# Altium schematic sheet MotorPower.SchDoc
size A4
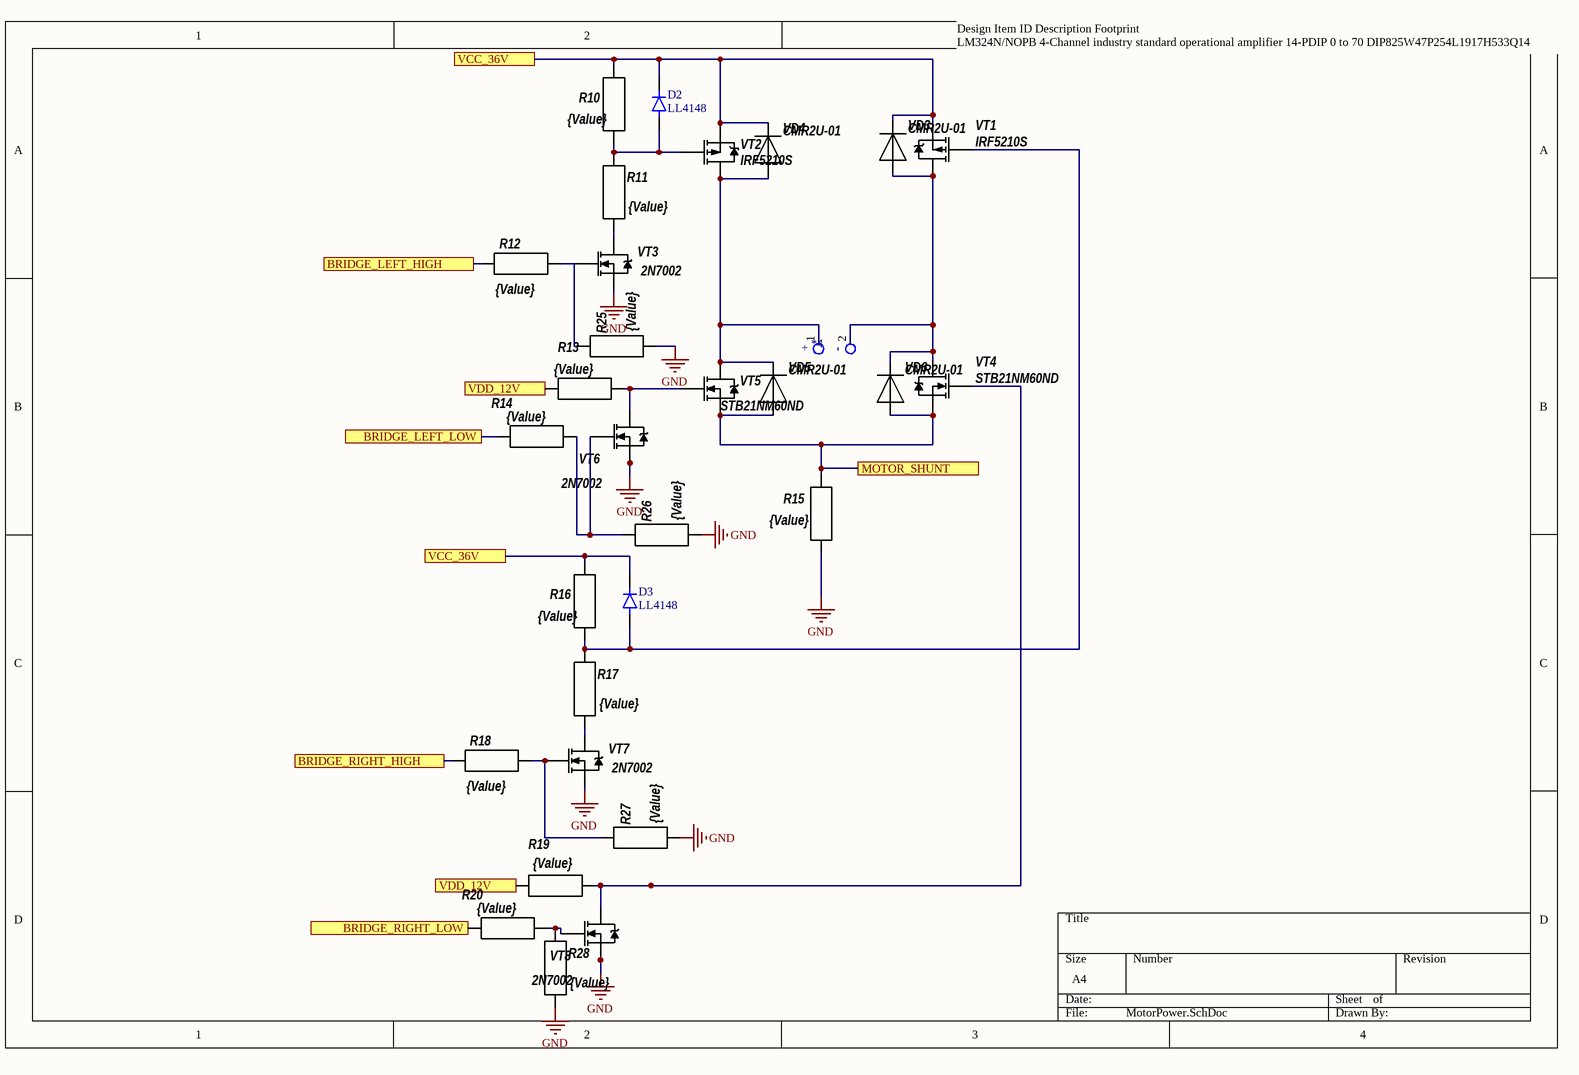
[diagram p0: MotorPower.SchDoc]

## Parts
*4  Power connector 2pin  [Power connector 2 pin]  (value not drawn)
D2  LL4148  [DIO_LL4148]
D3  LL4148  [DIO_LL4148]
R10  value {Value}  [R0805]  (hidden comment: Res 0805)
R11  value {Value}  [R0805]  (hidden comment: Res 0805)
R12  value {Value}  [R0805]  (hidden comment: Res 0805)
R13  value {Value}  [R0805]  (hidden comment: Res 0805)
R14  value {Value}  [R0805]  (hidden comment: Res 0805)
R15  value {Value}  [R2512]  (hidden comment: Res 2512)
R16  value {Value}  [R0805]  (hidden comment: Res 0805)
R17  value {Value}  [R0805]  (hidden comment: Res 0805)
R18  value {Value}  [R0805]  (hidden comment: Res 0805)
R19  value {Value}  [R0805]  (hidden comment: Res 0805)
R20  value {Value}  [R0805]  (hidden comment: Res 0805)
R25  value {Value}  [R0805]  (hidden comment: Res 0805)
R26  value {Value}  [R0805]  (hidden comment: Res 0805)
R27  value {Value}  [R0805]  (hidden comment: Res 0805)
R28  value {Value}  [R0805]  (hidden comment: Res 0805)
VD3  CMR2U-01  [SMB/DO-214AA]
VD4  CMR2U-01  [SMB/DO-214AA]
VD5  CMR2U-01  [SMB/DO-214AA]
VD6  CMR2U-01  [SMB/DO-214AA]
VT1  IRF5210S  [D2Pak]
VT2  IRF5210S  [D2Pak]
VT3  2N7002  [SOT-23]
VT4  STB21NM60ND  [D2Pak]
VT5  STB21NM60ND  [D2Pak]
VT6  2N7002  [SOT-23]
VT7  2N7002  [SOT-23]
VT8  2N7002  [SOT-23]

## Ports
BRIDGE_LEFT_HIGH, BRIDGE_LEFT_LOW, BRIDGE_RIGHT_HIGH, BRIDGE_RIGHT_LOW, MOTOR_SHUNT, VCC_36V, VDD_12V

## Nets
GND: R15.1 R25.1 R26.1 R27.1 R28.1 VT3.2(S) VT6.2(S) VT7.2(S) VT8.2(S)
BRIDGE_LEFT_HIGH: R12.2 ; port BRIDGE_LEFT_HIGH
BRIDGE_LEFT_LOW: R14.1 ; port BRIDGE_LEFT_LOW
BRIDGE_RIGHT_HIGH: R18.2 ; port BRIDGE_RIGHT_HIGH
BRIDGE_RIGHT_LOW: R20.1 ; port BRIDGE_RIGHT_LOW
MOTOR_SHUNT: R15.2 VD5.1 VD6.1 VT4.3(S) VT5.3(S) ; port MOTOR_SHUNT
VCC_36V: D2.C D3.C R10.2 R16.2 VD3.2 VD4.2 VT1.3(S) VT2.3(S) ; port VCC_36V
VDD_12V: R13.1 R19.1 ; port VDD_12V
Net*4_1: *4.1 VD4.1 VD5.2 VT2.2(D) VT5.2(D)
Net*4_2: *4.2 VD3.1 VD6.2 VT1.2(D) VT4.2(D)
NetD2_A: D2.A R10.1 R11.2 VT2.1(G)
NetD3_A: D3.A R16.1 R17.2 VT1.1(G)
NetR11_1: R11.1 VT3.3(D)
NetR12_1: R12.1 R25.2 VT3.1(G)
NetR13_2: R13.2 VT5.1(G) VT6.3(D)
NetR14_2: R14.2 R26.2 VT6.1(G)
NetR17_1: R17.1 VT7.3(D)
NetR18_1: R18.1 R27.2 VT7.1(G)
NetR19_2: R19.2 VT4.1(G) VT8.3(D)
NetR20_2: R20.2 R28.2 VT8.1(G)

## Notes on the sheet
- Design Item ID	Description	Footprint
  LM324N/NOPB	4-Channel industry standard operational amplifier 14-PDIP 0 to 70	DIP825W47P254L1917H533Q14
- (in symbol Power connector 2pin) +; -

## Library data of the parts
D2 D3 = LL4148: Diode Standard 100V 200mA Surface Mount SOD-80; MF: ON Semiconductor; Package: SOD-80 Taitron; Availability: Unavailable; MP: LL4148; Value: *; SnapEDA_Link: https://www.snapeda.com/parts/LL4148/ON%20Semiconductor/view-part/2182678/?ref=snap; Price: None
R10-R14 R16-R20 R25-R28 = Res 0805: Резистор 0805; Manufacturer: Yageo; sm_pins: 2; th_pins: 0; Model: *
R15 = Res 2512: Резистор 2512; Manufacturer: Yageo; sm_pins: 2; th_pins: 0; Model: 2512
VD3-VD6 = CMR2U-01: Ultrafast, 100V, 2A, 50 ns; Manufacturer: Central Semiconductor Corp; Model: CMR2U-01
VT1 VT2 = IRF5210S: P-chanel, 100V, 40A, 60 mOhm; Manufacturer: International Rectifier; Model: IRF5210SPBF
VT3 VT6-VT8 = 2N7002: 60V, 200 mA, N-chanel; Manufacturer: ON Semiconductor; sm_pins: 3; th_pins: 0; Model: 2N7002LT1G
VT4 VT5 = STB21NM60ND: D2pak, 600V, 17А, 170 mOhm; Manufacturer: ST Microelectronics; Model: STB21NM60ND